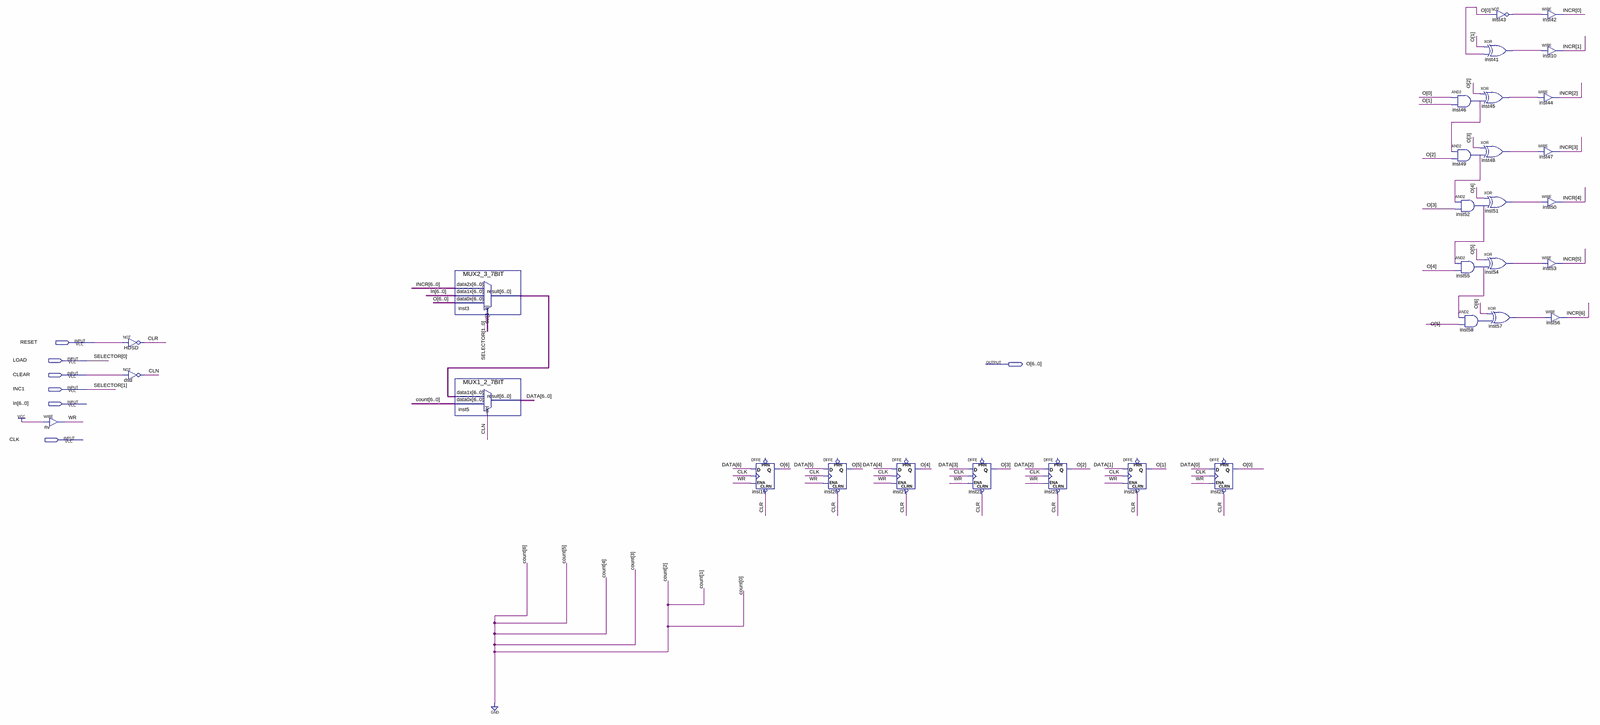
[diagram p0: schematic sheet, whole]
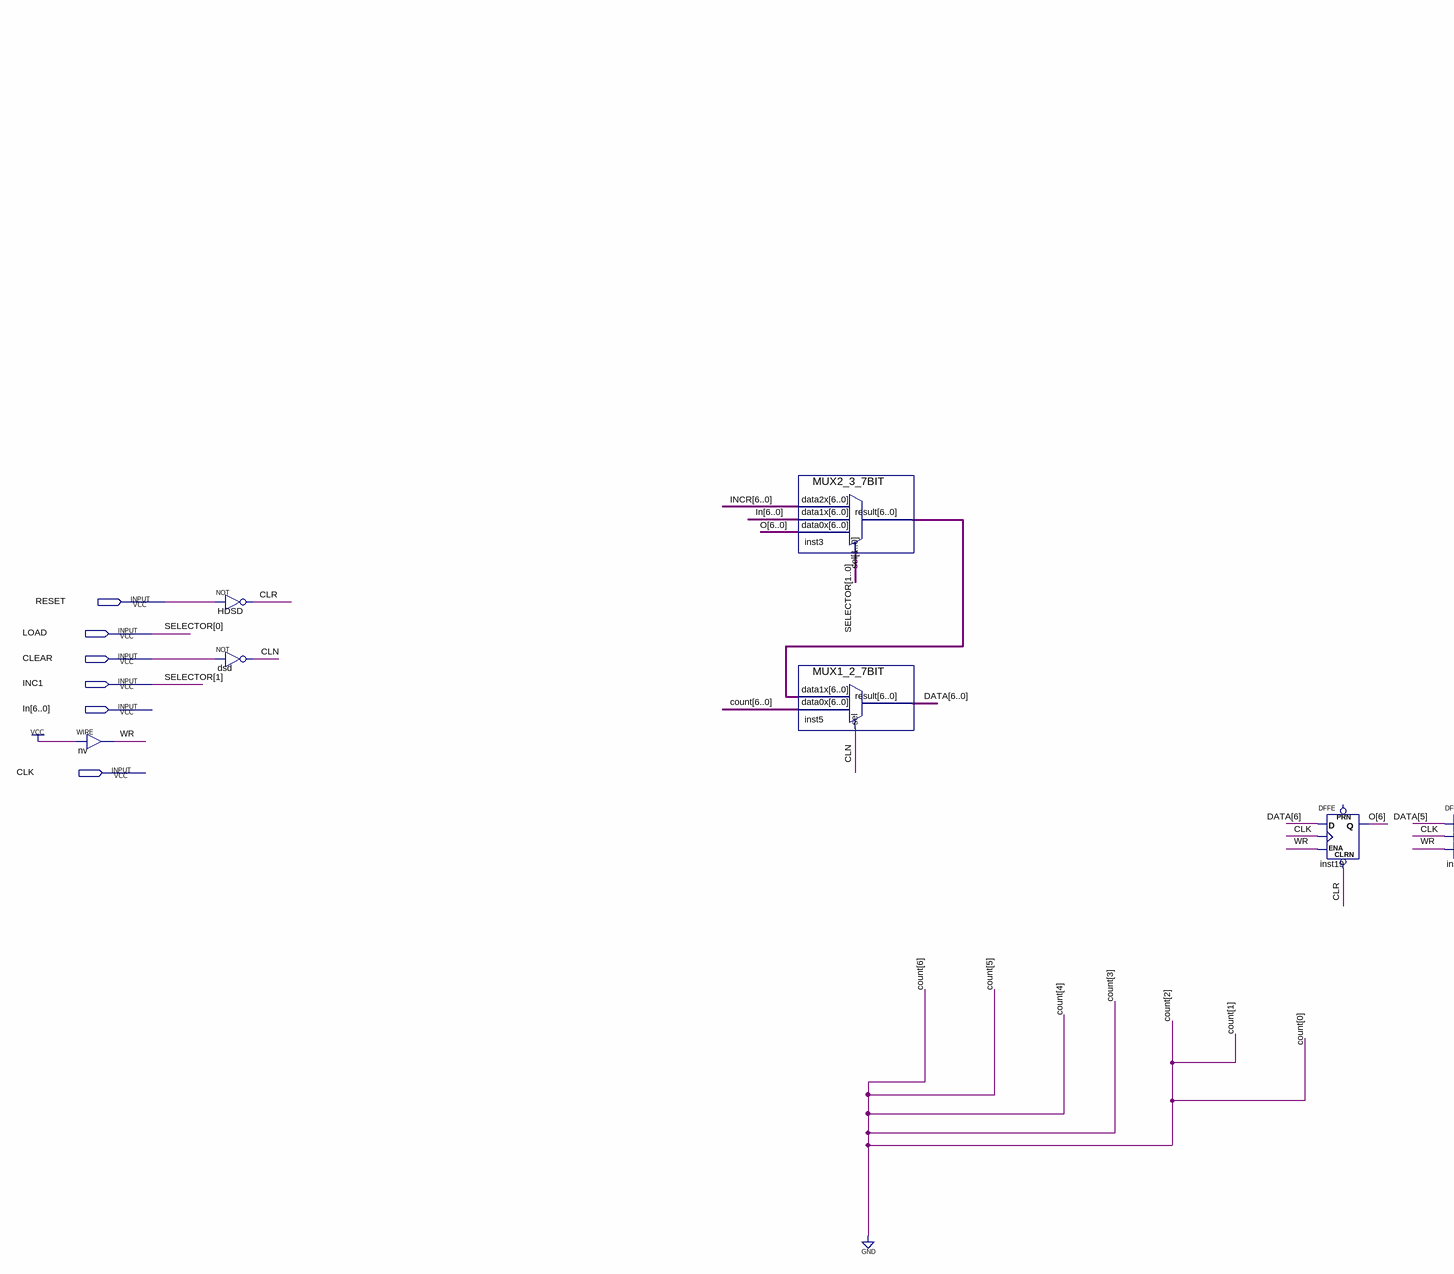
[diagram p1: schematic sheet, left part]
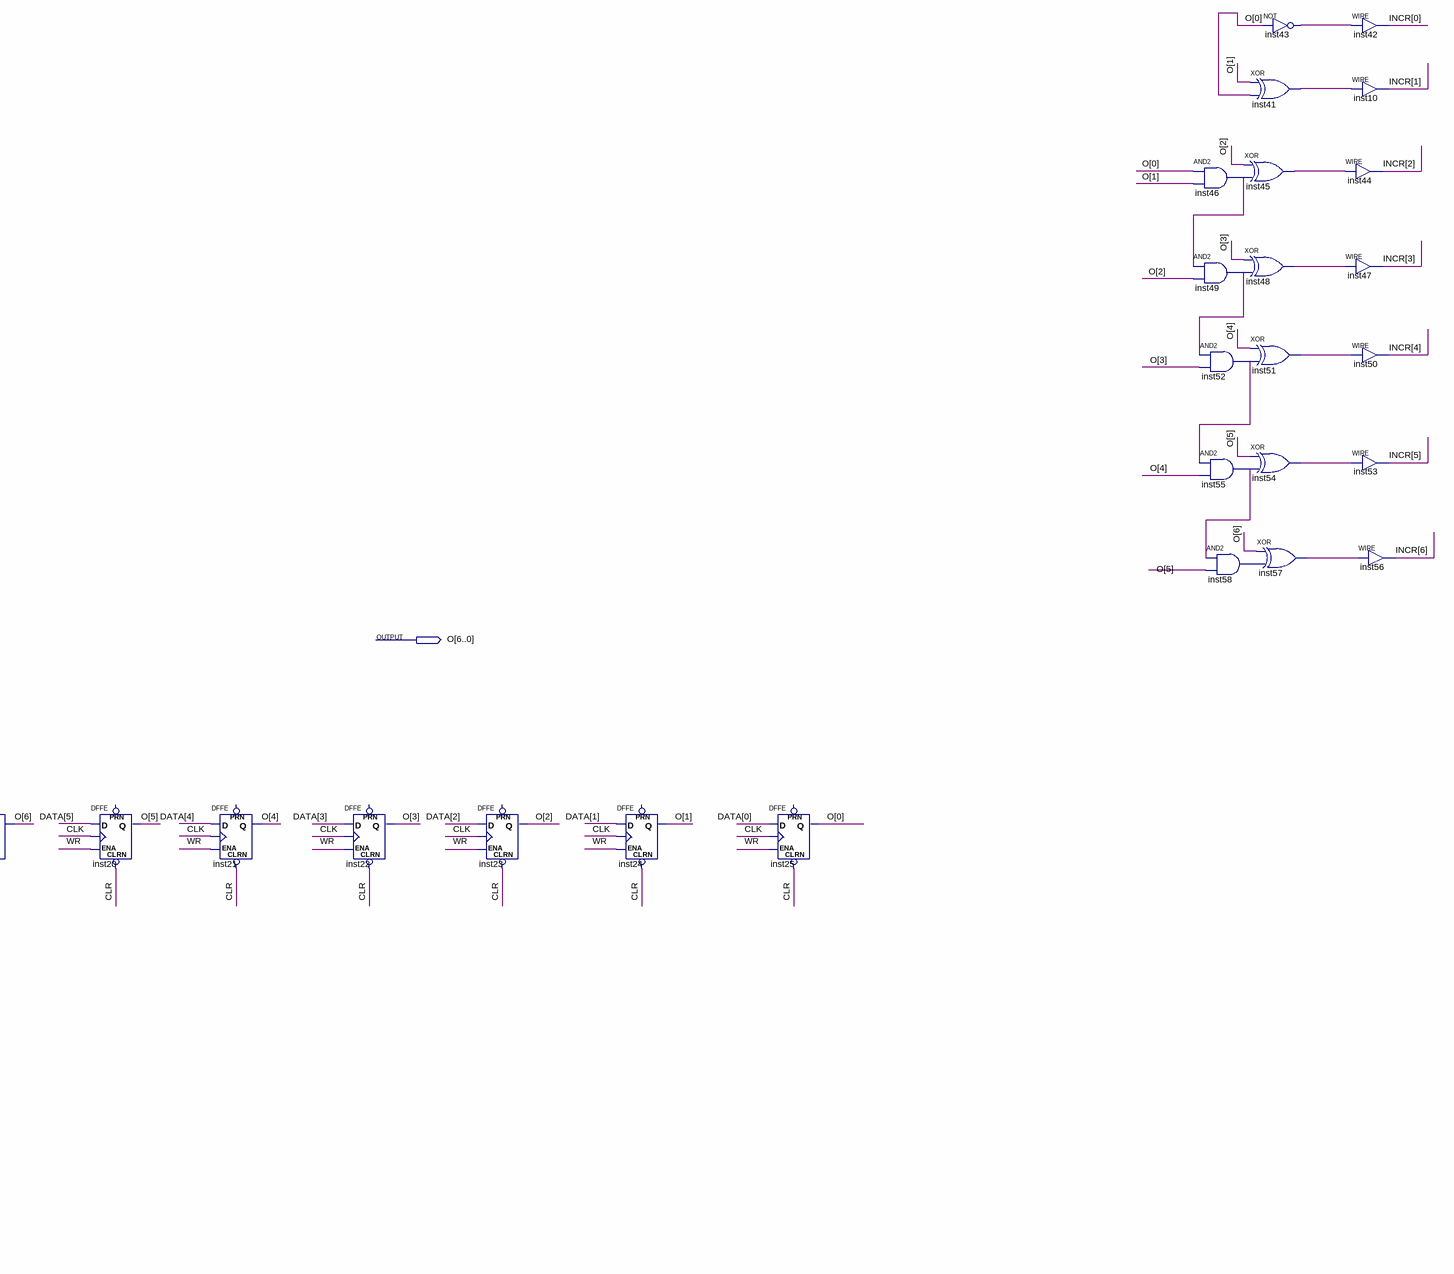
[diagram p2: schematic sheet, right part]
// Quartus schematic REG_7BIT.bdf as structural Verilog: 31 symbols, 7 pins
module REG_7BIT (
  input  RESET,
  input  LOAD,
  input  CLEAR,
  input  INC1,
  input  [6:0] In,
  input  CLK,
  output [6:0] O
);

  wire CLN, CLR, inst41_out, inst43_out, inst45_out, inst46_out, inst48_out, inst49_out, inst51_out,
       inst52_out, inst54_out, inst55_out, inst57_out, inst58_out, WR;
  wire [6:0] DATA, INCR, inst3_result;

  assign WR = 1'b1;  // WIRE nv
  not HDSD (CLR, RESET);
  not dsd (CLN, CLEAR);
  MUX2_3_7BIT inst3 (.data2x(INCR), .data1x(In), .data0x(O), .sel({INC1, LOAD}), .result(inst3_result));
  MUX1_2_7BIT inst5 (.data1x(inst3_result), .data0x({7{1'b0}}), .sel(CLN), .result(DATA));
  DFFE inst19 (.CLRN(CLR), .D(DATA[6]), .CLK(CLK), .ENA(WR), .Q(O[6]));  // open: PRN
  DFFE inst20 (.CLRN(CLR), .D(DATA[5]), .CLK(CLK), .ENA(WR), .Q(O[5]));  // open: PRN
  DFFE inst21 (.CLRN(CLR), .D(DATA[4]), .CLK(CLK), .ENA(WR), .Q(O[4]));  // open: PRN
  DFFE inst22 (.CLRN(CLR), .D(DATA[3]), .CLK(CLK), .ENA(WR), .Q(O[3]));  // open: PRN
  DFFE inst23 (.CLRN(CLR), .D(DATA[2]), .CLK(CLK), .ENA(WR), .Q(O[2]));  // open: PRN
  DFFE inst24 (.CLRN(CLR), .D(DATA[1]), .CLK(CLK), .ENA(WR), .Q(O[1]));  // open: PRN
  DFFE inst25 (.CLRN(CLR), .D(DATA[0]), .CLK(CLK), .ENA(WR), .Q(O[0]));  // open: PRN
  and inst46 (inst46_out, O[0], O[1]);
  and inst49 (inst49_out, inst46_out, O[2]);
  and inst52 (inst52_out, inst49_out, O[3]);
  and inst55 (inst55_out, inst52_out, O[4]);
  and inst58 (inst58_out, inst55_out, O[5]);
  not inst43 (inst43_out, O[0]);
  xor inst41 (inst41_out, O[1], O[0]);
  xor inst45 (inst45_out, O[2], inst46_out);
  xor inst48 (inst48_out, O[3], inst49_out);
  xor inst51 (inst51_out, O[4], inst52_out);
  xor inst54 (inst54_out, O[5], inst55_out);
  xor inst57 (inst57_out, O[6], inst58_out);
  assign INCR[0] = inst43_out;  // WIRE inst42
  assign INCR[1] = inst41_out;  // WIRE inst10
  assign INCR[2] = inst45_out;  // WIRE inst44
  assign INCR[3] = inst48_out;  // WIRE inst47
  assign INCR[4] = inst51_out;  // WIRE inst50
  assign INCR[5] = inst54_out;  // WIRE inst53
  assign INCR[6] = inst57_out;  // WIRE inst56

  // Other names for the same wires on the sheet: SELECTOR[1:0] = {INC1, LOAD}
endmodule
